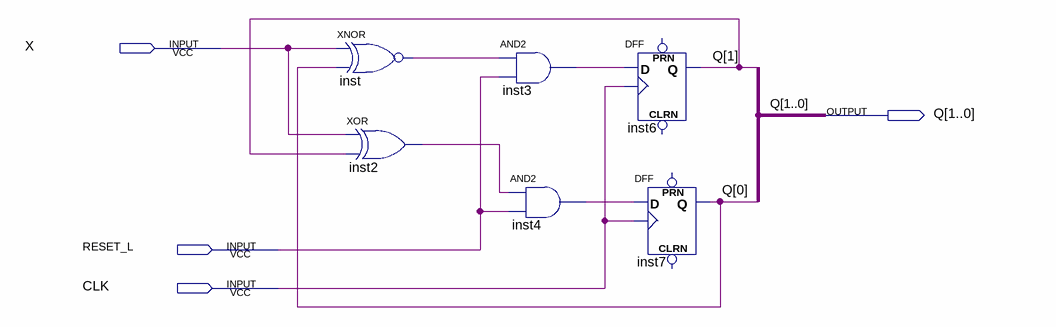
[diagram p0: schematic sheet]
// Quartus schematic MEF.bdf as structural Verilog: 6 symbols, 4 pins
module MEF (
  input  X,
  input  RESET_L,
  input  CLK,
  output [1:0] Q
);

  wire inst2_out, inst3_out, inst4_out, inst_out;

  xnor inst (inst_out, X, Q[0]);
  xor inst2 (inst2_out, X, Q[1]);
  and inst3 (inst3_out, inst_out, RESET_L);
  and inst4 (inst4_out, inst2_out, RESET_L);
  DFF inst6 (.CLK(CLK), .D(inst3_out), .Q(Q[1]));  // open: CLRN, PRN
  DFF inst7 (.CLK(CLK), .D(inst4_out), .Q(Q[0]));  // open: CLRN, PRN
endmodule
